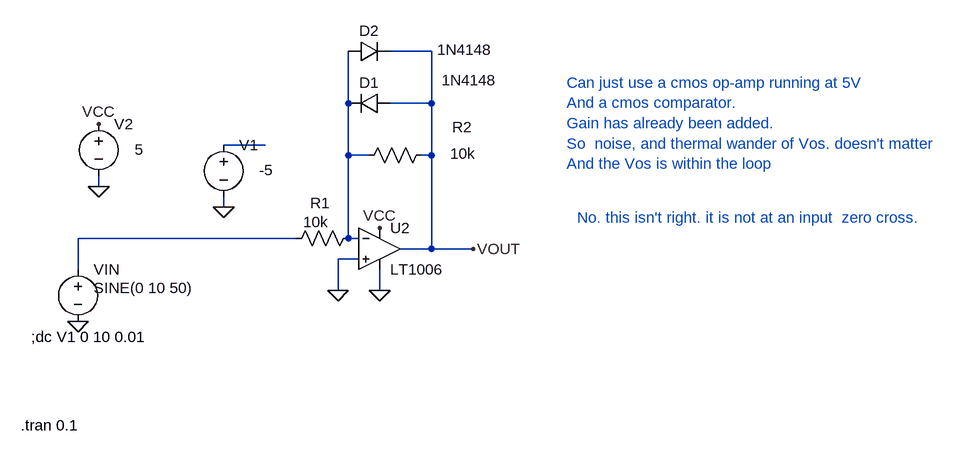
[diagram p0: schematic Draft101.asc]
Draft101.asc, the LTspice schematic file:
Version 4
SHEET 1 1316 680
WIRE 496 -208 432 -208
WIRE 368 -128 368 -208
WIRE 496 -128 496 -208
WIRE 496 -128 432 -128
WIRE 240 -64 176 -64
WIRE 368 -48 368 -128
WIRE 400 -48 368 -48
WIRE 496 -48 496 -128
WIRE 496 -48 480 -48
WIRE -16 0 -16 -16
WIRE 176 32 176 16
WIRE 288 80 -48 80
WIRE 368 80 368 -48
WIRE 384 80 368 80
WIRE 496 96 496 -48
WIRE 496 96 448 96
WIRE 560 96 496 96
WIRE 384 112 352 112
WIRE -48 128 -48 80
WIRE 352 160 352 112
WIRE 416 160 416 128
FLAG -48 208 0
FLAG -16 0 0
FLAG 560 96 VOUT
FLAG 352 160 0
FLAG -16 -96 VCC
FLAG 416 64 VCC
FLAG 416 160 0
FLAG 176 32 0
SYMBOL voltage -48 112 R0
WINDOW 123 0 0 Left 0
WINDOW 39 0 0 Left 0
WINDOW 3 24 44 Left 2
SYMATTR Value SINE(0 10 50)
SYMATTR InstName VIN
SYMBOL voltage -16 -112 R0
WINDOW 123 0 0 Left 0
WINDOW 39 0 0 Left 0
WINDOW 3 55 55 Left 2
SYMATTR Value 5
SYMATTR InstName V2
SYMBOL res 384 64 R90
WINDOW 0 -23 59 VBottom 2
WINDOW 3 -25 66 VTop 2
SYMATTR InstName R1
SYMATTR Value 10k
SYMBOL res 496 -64 R90
WINDOW 0 -12 -47 VBottom 2
WINDOW 3 -2 -48 VTop 2
SYMATTR InstName R2
SYMATTR Value 10k
SYMBOL diode 432 -144 R90
WINDOW 0 0 32 VBottom 2
WINDOW 3 -35 -122 VTop 2
SYMATTR InstName D1
SYMATTR Value 1N4148
SYMBOL diode 368 -192 R270
WINDOW 0 32 32 VTop 2
WINDOW 3 34 179 VBottom 2
SYMATTR InstName D2
SYMATTR Value 1N4148
SYMBOL OpAmps\\LT1006 416 32 R0
SYMATTR InstName U2
SYMBOL voltage 176 -80 R0
WINDOW 123 0 0 Left 0
WINDOW 39 0 0 Left 0
WINDOW 3 55 55 Left 2
SYMATTR Value -5
SYMATTR InstName V1
TEXT -120 232 Left 2 !;dc V1 0 10 0.01
TEXT -136 368 Left 2 !.tran 0.1
TEXT 704 -160 Left 2 ;Can just use a cmos op-amp running at 5V\nAnd a cmos comparator.\nGain has already been added.\nSo  noise, and thermal wander of Vos. doesn't matter\nAnd the Vos is within the loop
TEXT 720 48 Left 2 ;No. this isn't right. it is not at an input  zero cross.

The netlist it stands for:
* Draft101.asc
VIN N003 0 SINE(0 10 50)
V2 VCC 0 5
R1 N001 N003 10k
R2 VOUT N001 10k
D1 VOUT N001 1N4148
D2 N001 VOUT 1N4148
XU2 0 N001 VCC 0 VOUT LT1006  ; pins In+ In- V+ V- OUT
V1 N002 0 -5
.model D D
.lib standard.dio
;dc V1 0 10 0.01
.tran 0.1
* Can just use a cmos op-amp running at 5V
* And a cmos comparator.
* Gain has already been added.
* So  noise, and thermal wander of Vos. doesn't matter
* And the Vos is within the loop
* No. this isn't right. it is not at an input  zero cross.
.lib LTC.lib
.backanno
.end